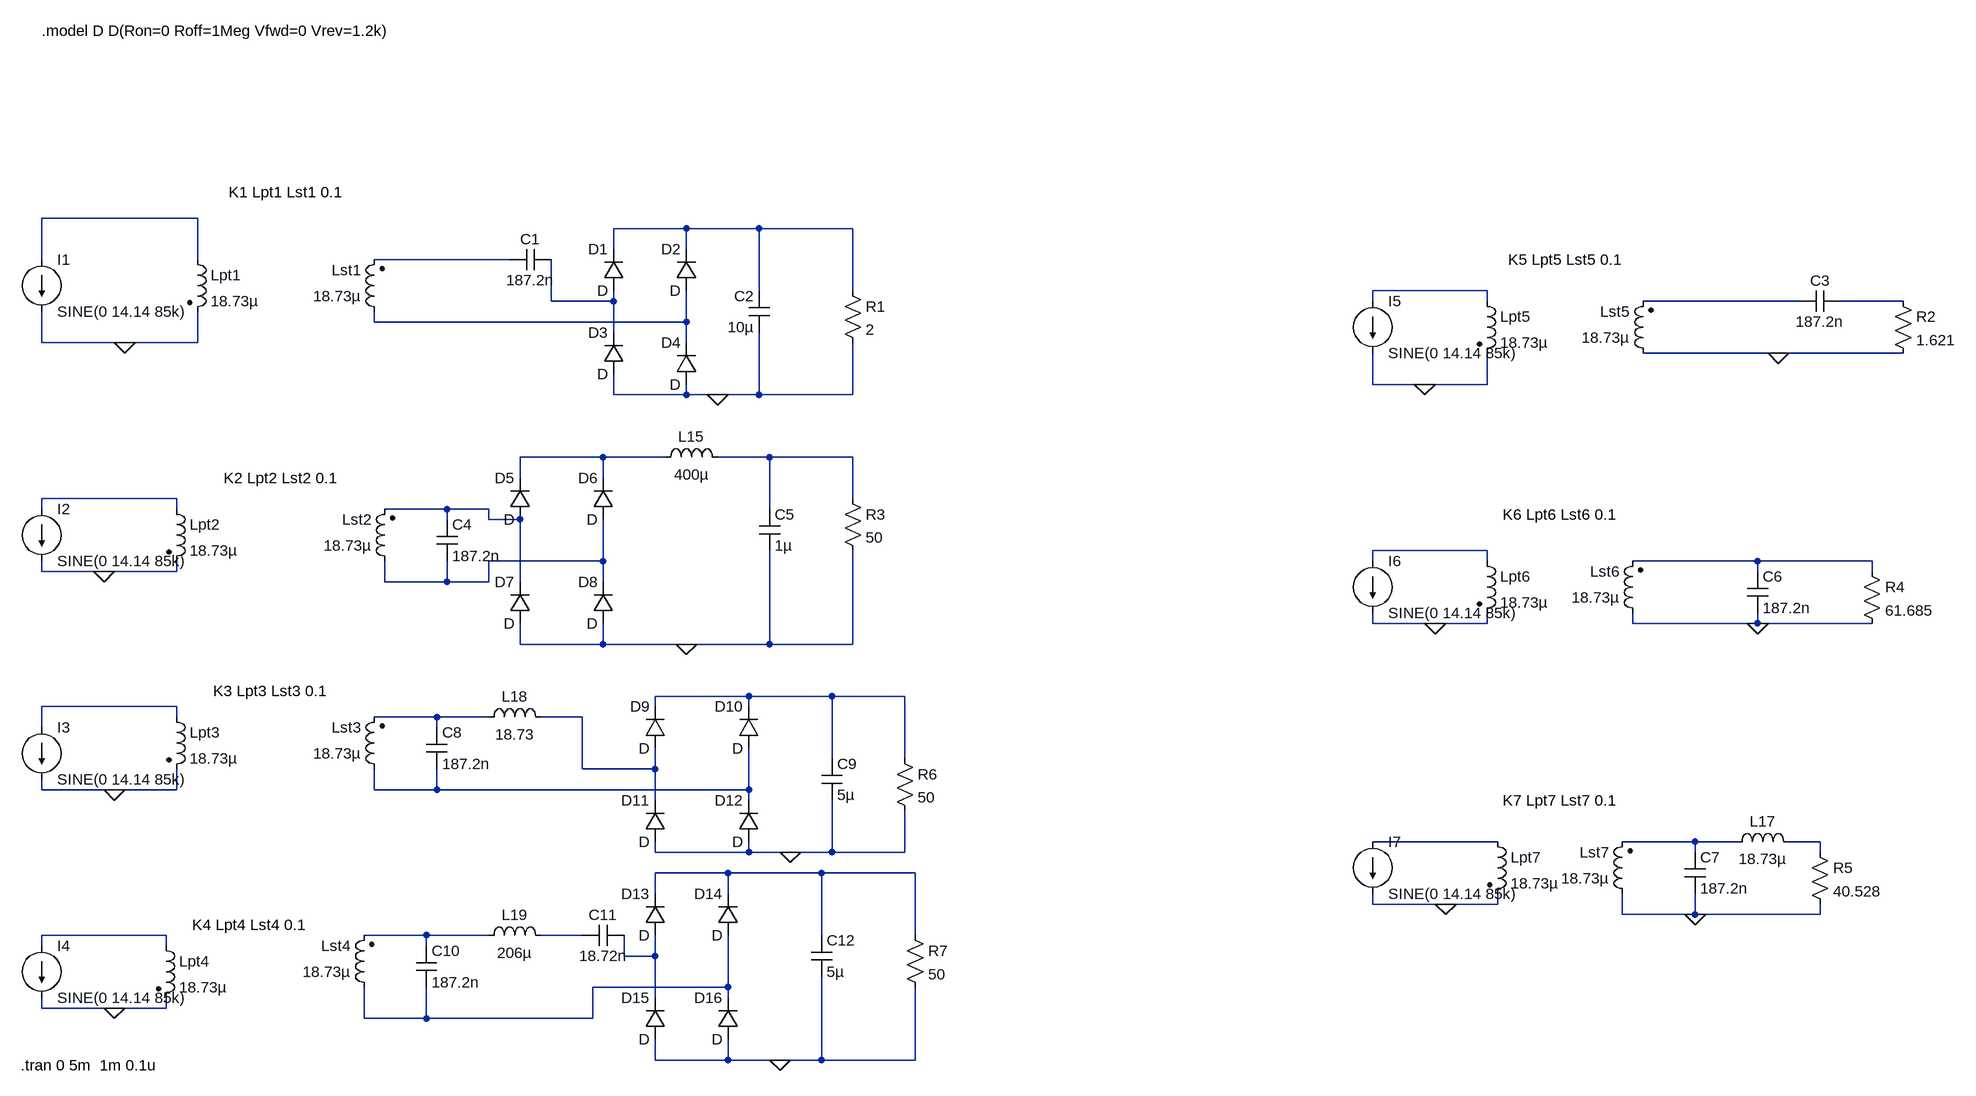
[diagram p0: schematic Rectifiers.asc]
Rectifiers.asc, the LTspice schematic file:
Version 4
SHEET 1 2824 1324
WIRE 112 0 -128 0
WIRE 864 16 752 16
WIRE 976 16 864 16
WIRE 1120 16 976 16
WIRE 752 48 752 16
WIRE 864 48 864 16
WIRE -128 64 -128 0
WIRE 112 64 112 0
WIRE 592 64 384 64
WIRE 976 112 976 16
WIRE 1120 112 1120 16
WIRE 2096 112 1920 112
WIRE 656 128 656 64
WIRE 752 128 752 112
WIRE 752 128 656 128
WIRE 1920 128 1920 112
WIRE 2096 128 2096 112
WIRE 2576 128 2336 128
WIRE 2736 128 2640 128
WIRE 384 160 384 144
WIRE 864 160 864 112
WIRE 864 160 384 160
WIRE 752 176 752 128
WIRE -128 192 -128 144
WIRE 0 192 -128 192
WIRE 112 192 112 144
WIRE 112 192 0 192
WIRE 864 192 864 160
WIRE 2544 208 2336 208
WIRE 2736 208 2544 208
WIRE 1920 256 1920 208
WIRE 2000 256 1920 256
WIRE 2096 256 2096 208
WIRE 2096 256 2000 256
WIRE 752 272 752 240
WIRE 864 272 864 256
WIRE 864 272 752 272
WIRE 912 272 864 272
WIRE 976 272 976 176
WIRE 976 272 912 272
WIRE 1120 272 1120 192
WIRE 1120 272 976 272
WIRE 736 368 608 368
WIRE 832 368 736 368
WIRE 992 368 912 368
WIRE 1120 368 992 368
WIRE 608 400 608 368
WIRE 736 400 736 368
WIRE 80 432 -128 432
WIRE 1120 432 1120 368
WIRE -128 448 -128 432
WIRE 80 448 80 432
WIRE 496 448 400 448
WIRE 560 448 496 448
WIRE 992 448 992 368
WIRE 496 464 496 448
WIRE 560 464 560 448
WIRE 608 464 560 464
WIRE 2096 512 1920 512
WIRE 736 528 736 464
WIRE 736 528 560 528
WIRE 1920 528 1920 512
WIRE 2096 528 2096 512
WIRE 2512 528 2320 528
WIRE 2688 528 2512 528
WIRE -128 544 -128 528
WIRE -32 544 -128 544
WIRE 80 544 80 528
WIRE 80 544 -32 544
WIRE 2512 544 2512 528
WIRE 2688 544 2688 528
WIRE 400 560 400 528
WIRE 496 560 496 528
WIRE 496 560 400 560
WIRE 560 560 560 528
WIRE 560 560 496 560
WIRE 608 560 608 464
WIRE 736 560 736 528
WIRE 1920 624 1920 608
WIRE 2016 624 1920 624
WIRE 2096 624 2096 608
WIRE 2096 624 2016 624
WIRE 2320 624 2320 608
WIRE 2512 624 2512 608
WIRE 2512 624 2320 624
WIRE 2688 624 2512 624
WIRE 608 656 608 624
WIRE 736 656 736 624
WIRE 736 656 608 656
WIRE 864 656 736 656
WIRE 992 656 992 512
WIRE 992 656 864 656
WIRE 1120 656 1120 512
WIRE 1120 656 992 656
WIRE 960 736 816 736
WIRE 1088 736 960 736
WIRE 1200 736 1088 736
WIRE 80 752 -128 752
WIRE 816 752 816 736
WIRE 960 752 960 736
WIRE 80 768 80 752
WIRE 480 768 384 768
WIRE 560 768 480 768
WIRE 704 768 640 768
WIRE -128 784 -128 752
WIRE 480 784 480 768
WIRE 1088 832 1088 736
WIRE 1200 832 1200 736
WIRE 704 848 704 768
WIRE 816 848 816 816
WIRE 816 848 704 848
WIRE -128 880 -128 864
WIRE -16 880 -128 880
WIRE 80 880 80 848
WIRE 80 880 -16 880
WIRE 384 880 384 848
WIRE 480 880 480 848
WIRE 480 880 384 880
WIRE 960 880 960 816
WIRE 960 880 480 880
WIRE 816 896 816 848
WIRE 960 896 960 880
WIRE 2112 960 1920 960
WIRE 2416 960 2304 960
WIRE 2480 960 2416 960
WIRE 2608 960 2560 960
WIRE 816 976 816 960
WIRE 960 976 960 960
WIRE 960 976 816 976
WIRE 1024 976 960 976
WIRE 1088 976 1088 896
WIRE 1088 976 1024 976
WIRE 1200 976 1200 912
WIRE 1200 976 1088 976
WIRE 2416 976 2416 960
WIRE 2608 976 2608 960
WIRE 928 1008 816 1008
WIRE 1072 1008 928 1008
WIRE 1216 1008 1072 1008
WIRE 816 1040 816 1008
WIRE 928 1040 928 1008
WIRE 1920 1056 1920 1040
WIRE 2032 1056 1920 1056
WIRE 2112 1056 2112 1040
WIRE 2112 1056 2032 1056
WIRE 2304 1072 2304 1040
WIRE 2416 1072 2416 1040
WIRE 2416 1072 2304 1072
WIRE 2608 1072 2608 1056
WIRE 2608 1072 2416 1072
WIRE 64 1104 -128 1104
WIRE 464 1104 368 1104
WIRE 560 1104 464 1104
WIRE 704 1104 640 1104
WIRE 1072 1104 1072 1008
WIRE 1216 1104 1216 1008
WIRE -128 1120 -128 1104
WIRE 64 1120 64 1104
WIRE 464 1120 464 1104
WIRE 768 1136 768 1104
WIRE 816 1136 816 1104
WIRE 816 1136 768 1136
WIRE 928 1184 928 1104
WIRE 928 1184 720 1184
WIRE 816 1200 816 1136
WIRE 928 1200 928 1184
WIRE -128 1216 -128 1200
WIRE -16 1216 -128 1216
WIRE 64 1216 64 1200
WIRE 64 1216 -16 1216
WIRE 368 1232 368 1184
WIRE 464 1232 464 1184
WIRE 464 1232 368 1232
WIRE 720 1232 720 1184
WIRE 720 1232 464 1232
WIRE 816 1296 816 1264
WIRE 928 1296 928 1264
WIRE 928 1296 816 1296
WIRE 1008 1296 928 1296
WIRE 1072 1296 1072 1168
WIRE 1072 1296 1008 1296
WIRE 1216 1296 1216 1184
WIRE 1216 1296 1072 1296
FLAG 0 192 0
FLAG 912 272 0
FLAG 864 656 0
FLAG -32 544 0
FLAG -16 880 0
FLAG -16 1216 0
FLAG 1008 1296 0
FLAG 1024 976 0
FLAG 2000 256 0
FLAG 2016 624 0
FLAG 2032 1056 0
FLAG 2416 1072 0
FLAG 2512 624 0
FLAG 2544 208 0
SYMBOL current -128 64 R0
WINDOW 123 0 0 Left 0
WINDOW 39 0 0 Left 0
SYMATTR InstName I1
SYMATTR Value SINE(0 14.14 85k)
SYMBOL current -128 448 R0
WINDOW 123 0 0 Left 0
WINDOW 39 0 0 Left 0
SYMATTR InstName I2
SYMATTR Value SINE(0 14.14 85k)
SYMBOL current -128 784 R0
WINDOW 123 0 0 Left 0
WINDOW 39 0 0 Left 0
SYMATTR InstName I3
SYMATTR Value SINE(0 14.14 85k)
SYMBOL current -128 1120 R0
WINDOW 123 0 0 Left 0
WINDOW 39 0 0 Left 0
SYMATTR InstName I4
SYMATTR Value SINE(0 14.14 85k)
SYMBOL current 1920 128 R0
WINDOW 123 0 0 Left 0
WINDOW 39 0 0 Left 0
SYMATTR InstName I5
SYMATTR Value SINE(0 14.14 85k)
SYMBOL current 1920 528 R0
WINDOW 123 0 0 Left 0
WINDOW 39 0 0 Left 0
SYMATTR InstName I6
SYMATTR Value SINE(0 14.14 85k)
SYMBOL current 1920 960 R0
WINDOW 123 0 0 Left 0
WINDOW 39 0 0 Left 0
SYMATTR InstName I7
SYMATTR Value SINE(0 14.14 85k)
SYMBOL ind2 96 48 R0
SYMATTR InstName Lpt1
SYMATTR Value 18.73µ
SYMATTR Type ind
SYMBOL ind2 64 432 R0
SYMATTR InstName Lpt2
SYMATTR Value 18.73µ
SYMATTR Type ind
SYMBOL ind2 64 752 R0
SYMATTR InstName Lpt3
SYMATTR Value 18.73µ
SYMATTR Type ind
SYMBOL ind2 2080 112 R0
SYMATTR InstName Lpt5
SYMATTR Value 18.73µ
SYMATTR Type ind
SYMBOL ind2 2080 512 R0
SYMATTR InstName Lpt6
SYMATTR Value 18.73µ
SYMATTR Type ind
SYMBOL ind2 2096 944 R0
SYMATTR InstName Lpt7
SYMATTR Value 18.73µ
SYMATTR Type ind
SYMBOL ind2 400 160 R180
WINDOW 0 36 80 Left 2
WINDOW 3 36 40 Left 2
SYMATTR InstName Lst1
SYMATTR Value 18.73µ
SYMATTR Type ind
SYMBOL ind2 416 544 R180
WINDOW 0 36 80 Left 2
WINDOW 3 36 40 Left 2
SYMATTR InstName Lst2
SYMATTR Value 18.73µ
SYMATTR Type ind
SYMBOL ind2 400 864 R180
WINDOW 0 36 80 Left 2
WINDOW 3 36 40 Left 2
SYMATTR InstName Lst3
SYMATTR Value 18.73µ
SYMATTR Type ind
SYMBOL ind2 384 1200 R180
WINDOW 0 36 80 Left 2
WINDOW 3 36 40 Left 2
SYMATTR InstName Lst4
SYMATTR Value 18.73µ
SYMATTR Type ind
SYMBOL cap 656 48 R90
WINDOW 0 0 32 VBottom 2
WINDOW 3 32 32 VTop 2
SYMATTR InstName C1
SYMATTR Value 187.2n
SYMBOL cap 992 176 R180
WINDOW 0 24 56 Left 2
WINDOW 3 24 8 Left 2
SYMATTR InstName C2
SYMATTR Value 10µ
SYMBOL res 1104 96 R0
SYMATTR InstName R1
SYMATTR Value 2
SYMBOL diode 768 112 R180
WINDOW 0 24 64 Left 2
WINDOW 3 24 0 Left 2
SYMATTR InstName D1
SYMBOL diode 880 112 R180
WINDOW 0 24 64 Left 2
WINDOW 3 24 0 Left 2
SYMATTR InstName D2
SYMBOL diode 768 240 R180
WINDOW 0 24 64 Left 2
WINDOW 3 24 0 Left 2
SYMATTR InstName D3
SYMBOL diode 880 256 R180
WINDOW 0 24 64 Left 2
WINDOW 3 24 0 Left 2
SYMATTR InstName D4
SYMBOL ind2 2352 224 R180
WINDOW 0 36 80 Left 2
WINDOW 3 36 40 Left 2
SYMATTR InstName Lst5
SYMATTR Value 18.73µ
SYMATTR Type ind
SYMBOL ind2 2320 1056 R180
WINDOW 0 36 80 Left 2
WINDOW 3 36 40 Left 2
SYMATTR InstName Lst7
SYMATTR Value 18.73µ
SYMATTR Type ind
SYMBOL cap 2640 112 R90
WINDOW 0 0 32 VBottom 2
WINDOW 3 32 32 VTop 2
SYMATTR InstName C3
SYMATTR Value 187.2n
SYMBOL res 2720 112 R0
SYMATTR InstName R2
SYMATTR Value 1.621
SYMBOL cap 480 464 R0
SYMATTR InstName C4
SYMATTR Value 187.2n
SYMBOL diode 624 464 R180
WINDOW 0 24 64 Left 2
WINDOW 3 24 0 Left 2
SYMATTR InstName D5
SYMBOL diode 752 464 R180
WINDOW 0 24 64 Left 2
WINDOW 3 24 0 Left 2
SYMATTR InstName D6
SYMBOL ind 816 384 R270
WINDOW 0 32 56 VTop 2
WINDOW 3 5 56 VBottom 2
SYMATTR InstName L15
SYMATTR Value 400µ
SYMBOL cap 976 448 R0
SYMATTR InstName C5
SYMATTR Value 1µ
SYMBOL res 1104 416 R0
SYMATTR InstName R3
SYMATTR Value 50
SYMBOL diode 624 624 R180
WINDOW 0 24 64 Left 2
WINDOW 3 24 0 Left 2
SYMATTR InstName D7
SYMBOL diode 752 624 R180
WINDOW 0 24 64 Left 2
WINDOW 3 24 0 Left 2
SYMATTR InstName D8
SYMBOL cap 2496 544 R0
SYMATTR InstName C6
SYMATTR Value 187.2n
SYMBOL res 2672 528 R0
SYMATTR InstName R4
SYMATTR Value 61.685
SYMBOL cap 2400 976 R0
SYMATTR InstName C7
SYMATTR Value 187.2n
SYMBOL ind 2464 976 R270
WINDOW 0 32 56 VTop 2
WINDOW 3 5 56 VBottom 2
SYMATTR InstName L17
SYMATTR Value 18.73µ
SYMBOL res 2592 960 R0
SYMATTR InstName R5
SYMATTR Value 40.528
SYMBOL cap 464 784 R0
SYMATTR InstName C8
SYMATTR Value 187.2n
SYMBOL ind 544 784 R270
WINDOW 0 32 56 VTop 2
WINDOW 3 5 56 VBottom 2
SYMATTR InstName L18
SYMATTR Value 18.73
SYMBOL diode 832 816 R180
WINDOW 0 24 64 Left 2
WINDOW 3 24 0 Left 2
SYMATTR InstName D9
SYMBOL diode 976 816 R180
WINDOW 0 24 64 Left 2
WINDOW 3 24 0 Left 2
SYMATTR InstName D10
SYMBOL diode 832 960 R180
WINDOW 0 24 64 Left 2
WINDOW 3 24 0 Left 2
SYMATTR InstName D11
SYMBOL diode 976 960 R180
WINDOW 0 24 64 Left 2
WINDOW 3 24 0 Left 2
SYMATTR InstName D12
SYMBOL cap 1072 832 R0
SYMATTR InstName C9
SYMATTR Value 5µ
SYMBOL res 1184 816 R0
SYMATTR InstName R6
SYMATTR Value 50
SYMBOL ind2 48 1104 R0
SYMATTR InstName Lpt4
SYMATTR Value 18.73µ
SYMATTR Type ind
SYMBOL cap 448 1120 R0
SYMATTR InstName C10
SYMATTR Value 187.2n
SYMBOL ind 544 1120 R270
WINDOW 0 32 56 VTop 2
WINDOW 3 5 56 VBottom 2
SYMATTR InstName L19
SYMATTR Value 206µ
SYMBOL cap 768 1088 R90
WINDOW 0 0 32 VBottom 2
WINDOW 3 32 32 VTop 2
SYMATTR InstName C11
SYMATTR Value 18.72n
SYMBOL diode 832 1104 R180
WINDOW 0 24 64 Left 2
WINDOW 3 24 0 Left 2
SYMATTR InstName D13
SYMBOL diode 944 1104 R180
WINDOW 0 24 64 Left 2
WINDOW 3 24 0 Left 2
SYMATTR InstName D14
SYMBOL diode 832 1264 R180
WINDOW 0 24 64 Left 2
WINDOW 3 24 0 Left 2
SYMATTR InstName D15
SYMBOL diode 944 1264 R180
WINDOW 0 24 64 Left 2
WINDOW 3 24 0 Left 2
SYMATTR InstName D16
SYMBOL cap 1056 1104 R0
SYMATTR InstName C12
SYMATTR Value 5µ
SYMBOL res 1200 1088 R0
SYMATTR InstName R7
SYMATTR Value 50
SYMBOL ind2 2336 624 R180
WINDOW 0 36 80 Left 2
WINDOW 3 36 40 Left 2
SYMATTR InstName Lst6
SYMATTR Value 18.73µ
SYMATTR Type ind
TEXT -128 -288 Left 2 !.model D D(Ron=0 Roff=1Meg Vfwd=0 Vrev=1.2k)
TEXT -160 1304 Left 2 !.tran 0 5m  1m 0.1u
TEXT 160 -40 Left 2 !K1 Lpt1 Lst1 0.1
TEXT 152 400 Left 2 !K2 Lpt2 Lst2 0.1
TEXT 136 728 Left 2 !K3 Lpt3 Lst3 0.1
TEXT 104 1088 Left 2 !K4 Lpt4 Lst4 0.1
TEXT 2128 64 Left 2 !K5 Lpt5 Lst5 0.1
TEXT 2120 456 Left 2 !K6 Lpt6 Lst6 0.1
TEXT 2120 896 Left 2 !K7 Lpt7 Lst7 0.1

The netlist it stands for:
* Rectifiers.asc
I1 N001 0 SINE(0 14.14 85k)
I2 N011 0 SINE(0 14.14 85k)
I3 N017 0 SINE(0 14.14 85k)
I4 N025 0 SINE(0 14.14 85k)
I5 N004 0 SINE(0 14.14 85k)
I6 N013 0 SINE(0 14.14 85k)
I7 N021 0 SINE(0 14.14 85k)
Lpt1 N001 0 18.73µ
Lpt2 N011 0 18.73µ
Lpt3 N017 0 18.73µ
Lpt5 N004 0 18.73µ
Lpt6 N013 0 18.73µ
Lpt7 N021 0 18.73µ
Lst1 N008 N003 18.73µ
Lst2 N014 N012 18.73µ
Lst3 N020 N018 18.73µ
Lst4 N029 N026 18.73µ
C1 N005 N003 187.2n
C2 0 N002 10µ
R1 N002 0 2
D1 N005 N002 D
D2 N008 N002 D
D3 0 N005 D
D4 0 N008 D
Lst5 0 N006 18.73µ
Lst7 0 N022 18.73µ
C3 N007 N006 187.2n
R2 N007 0 1.621
C4 N012 N014 187.2n
D5 N012 N009 D
D6 N014 N009 D
L15 N009 N010 400µ
C5 N010 0 1µ
R3 N010 0 50
D7 0 N012 D
D8 0 N014 D
C6 N015 0 187.2n
R4 N015 0 61.685
C7 N022 0 187.2n
L17 N022 N023 18.73µ
R5 N023 0 40.528
C8 N018 N020 187.2n
L18 N018 N019 18.73
D9 N019 N016 D
D10 N020 N016 D
D11 0 N019 D
D12 0 N020 D
C9 N016 0 5µ
R6 N016 0 50
Lpt4 N025 0 18.73µ
C10 N026 N029 187.2n
L19 N026 N027 206µ
C11 N028 N027 18.72n
D13 N028 N024 D
D14 N029 N024 D
D15 0 N028 D
D16 0 N029 D
C12 N024 0 5µ
R7 N024 0 50
Lst6 0 N015 18.73µ
.model D D
.lib standard.dio
.model D D(Ron=0 Roff=1Meg Vfwd=0 Vrev=1.2k)
.tran 0 5m  1m 0.1u
K1 Lpt1 Lst1 0.1
K2 Lpt2 Lst2 0.1
K3 Lpt3 Lst3 0.1
K4 Lpt4 Lst4 0.1
K5 Lpt5 Lst5 0.1
K6 Lpt6 Lst6 0.1
K7 Lpt7 Lst7 0.1
.backanno
.end